# EAGLE design Irnardo_REVA (EAGLE 6.4)
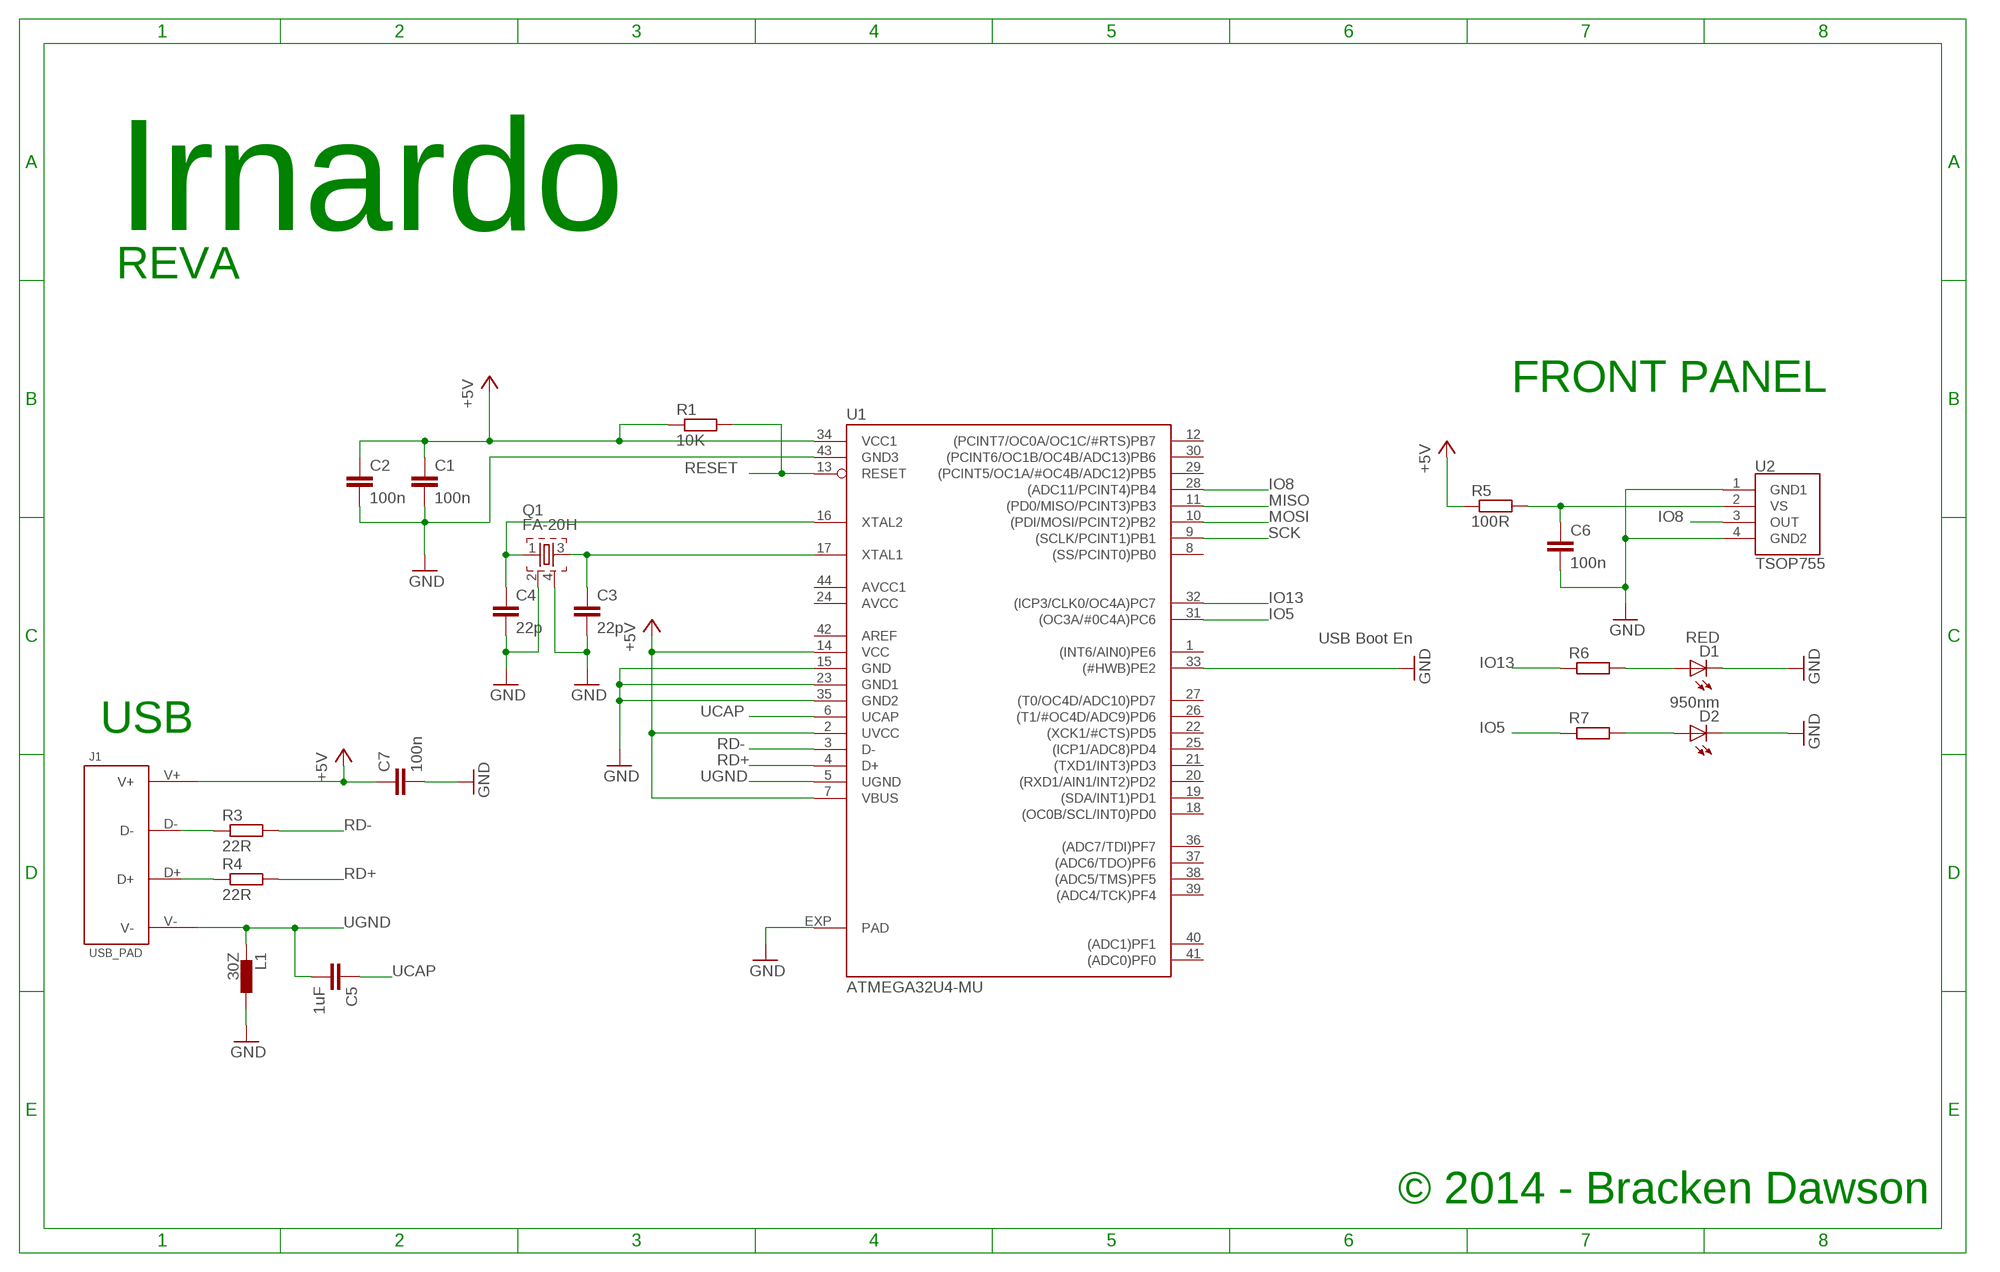
[diagram p0: schematic, sheet 1]

## Parts
C1  100n  C-EUC0402  [C0402]
C2  100n  C-EUC0402  [C0402]
C3  22p  C-EUC0402  [C0402]
C4  22p  C-EUC0402  [C0402]
C5  1uF  C-EUC0402  [C0402]
C6  100n  C-EUC0402  [C0402]
C7  100n  C-EUC0402  [C0402]
D1  RED  LEDSML0603  [SML0603]
D2  950nm  LEDSML0603  [SML0603]
J1  USB_PAD  [USB_PAD]
L1  30Z  BLM15HB121SN1  [0402]
Q1  FA-20H  [FA-20H]
R1  10K  R-EU_R0402  [R0402]
R3  22R  R-EU_R0402  [R0402]
R4  22R  R-EU_R0402  [R0402]
R5  100R  R-EU_R0402  [R0402]
R6  R-EU_R0402  [R0402]
R7  R-EU_R0402  [R0402]
U1  ATMEGA32U4-MU  SMARTPRJ_ATMEGA32U4-XUMU  [SMARTPRJ_QFN44ML7X7]
U2  TSOP755  [TSOP755]

## Nets
+5V: C1.1 C2.1 C7.1 J1.V+ R1.1 R5.1 U1.2(UVCC) U1.7(VBUS) U1.14(VCC) U1.34(VCC1)
D+: J1.D+ R4.1
D-: J1.D- R3.1
GND: C1.2 C2.2 C3.2 C4.2 C6.2 C7.2 D1.C D2.C L1.2 Q1.2 Q1.4 U1.15(GND) U1.23(GND1) U1.33((#HWB)PE2) U1.35(GND2) U1.43(GND3) U1.EXP(PAD) U2.1(GND1) U2.4(GND2)
IO5: R7.1 U1.31((OC3A/#0C4A)PC6)
IO8: U1.28((ADC11/PCINT4)PB4) U2.3(OUT)
IO13: R6.1 U1.32((ICP3/CLK0/OC4A)PC7)
MISO: U1.11((PD0/MISO/PCINT3)PB3)
MOSI: U1.10((PDI/MOSI/PCINT2)PB2)
N$1: C4.1 Q1.1 U1.16(XTAL2)
N$2: C3.1 Q1.3 U1.17(XTAL1)
N$5: C6.1 R5.2 U2.2(VS)
N$7: D2.A R7.2
N$8: D1.A R6.2
RD+: R4.2 U1.4(D+)
RD-: R3.2 U1.3(D-)
RESET: R1.2 U1.13(RESET)
SCK: U1.9((SCLK/PCINT1)PB1)
UCAP: C5.1 U1.6(UCAP)
UGND: C5.2 J1.V- L1.1 U1.5(UGND)
Unconnected: U1.1((INT6/AIN0)PE6) U1.8((SS/PCINT0)PB0) U1.12((PCINT7/OC0A/OC1C/#RTS)PB7) U1.18((OC0B/SCL/INT0)PD0) U1.19((SDA/INT1)PD1) U1.20((RXD1/AIN1/INT2)PD2) U1.21((TXD1/INT3)PD3) U1.22((XCK1/#CTS)PD5) U1.25((ICP1/ADC8)PD4) U1.26((T1/#OC4D/ADC9)PD6) U1.27((T0/OC4D/ADC10)PD7) U1.29((PCINT5/OC1A/#OC4B/ADC12)PB5) U1.30((PCINT6/OC1B/OC4B/ADC13)PB6) U1.36((ADC7/TDI)PF7) U1.37((ADC6/TDO)PF6) U1.38((ADC5/TMS)PF5) U1.39((ADC4/TCK)PF4) U1.40((ADC1)PF1) U1.41((ADC0)PF0)

## Notes on the sheet
- Irnardo
- REVA
- FRONT PANEL
- USB Boot En
- USB
- © 2014 - Bracken Dawson

## Power pins joined to a net without a drawn wire
AREF: U1.42(AREF)
AVCC: U1.24(AVCC)
AVCC1: U1.44(AVCC1)

## Library data of the parts
C1-C7 = resistor:C-EU: CAPACITOR, European symbol
D1 D2 = led:LED: LED OSRAM: - CHIPLED LG R971, LG N971, LY N971, LG Q971, LY Q971, LO R971, LY R971 LH N974, LH R974 LS Q976, LO Q976, LY Q976 LO Q996 - Hyper CHIPLED LW Q18S LB Q993, LB Q99A, LB R99A - SideLED LS A670, LO A670, LY A670, LG A670, LP A670 LB A673, LV A673, LT A673, LW A673 LH A674 LY A675 LS A676, LA A676, LO A676, LY A676, LW A676 LS A679, LY A679, LG A679 - Hyper Micro SIDELED® LS Y876, LA Y876, LO Y876, LY Y876 LT Y87S - SmartLED LW L88C, LW L88S LB L89C, LB L89S, LG L890 LS L89K, LO L89K, LY L89K LS L896, LA L896, LO L896, LY L896 - TOPLED LS T670, LO T670, LY T670, LG T670, LP T670 LSG T670, LSP T670, LSY T670, LOP T670, LYG T670 LG T671, LOG T671, LSG T671 LB T673, LV T673, LT T673, LW T673 LH T674 LS T676, LA T676, LO T676, LY T676, LB T676, LH T676, LSB T676, LW T676 LB T67C, LV T67C, LT T67C, LS T67K, LO T67K, LY T67K, LW E67C LS E67B, LA E67B, LO E67B, LY E67B, LB E67C, LV E67C, LT E67C LW T67C LS T679, LY T679, LG T679 LS T770, LO T770, LY T770, LG T770, LP T770 LB T773, LV T773, LT T773, LW T773 LH T774 LS E675, LA E675, LY E675, LS T675 LS T776, LA T776, LO T776, LY T776, LB T776 LHGB T686 LT T68C, LB T68C - Hyper Mini TOPLED® LB M676 - Mini TOPLED Santana® LG M470 LS M47K, LO M47K, LY M47K Source: http://www.osram.convergy.de LUXEON: - LUMILED® LXK2-PW12-R00, LXK2-PW12-S00, LXK2-PW14-U00, LXK2-PW14-V00 LXK2-PM12-R00, LXK2-PM12-S00, LXK2-PM14-U00 LXK2-PE12-Q00, LXK2-PE12-R00, LXK2-PE12-S00, LXK2-PE14-T00, LXK2-PE14-U00 LXK2-PB12-K00, LXK2-PB12-L00, LXK2-PB12-M00, LXK2-PB14-N00, LXK2-PB14-P00, LXK2-PB14-Q00 LXK2-PR12-L00, LXK2-PR12-M00, LXK2-PR14-Q00, LXK2-PR14-R00 LXK2-PD12-Q00, LXK2-PD12-R00, LXK2-PD12-S00 LXK2-PH12-R00, LXK2-PH12-S00 LXK2-PL12-P00, LXK2-PL12-Q00, LXK2-PL12-R00 Source: www.luxeon.com KINGBRIGHT: KA-3528ASYC Source: www.kingbright.com
J1 = USB_PAD:USB_PAD
L1 = inductors:BLM15H: EMIFIL (R) Chip Ferrite Bead for GHz Noise Source: http://www.murata.com/ Ferrite Bead BLM15H.pdf
Q1 = crystal:FA-: MHz RANGE CRYSTAL UNIT Source: Epson Toyocom
R1 R3-R7 = resistor:R-EU_: RESISTOR, European symbol
U1 = Arduino_Leonardo-REV3b:SMARTPRJ_ATMEGA32U4-XU
U2 = TSOP755:TSOP755; U: TSOP755

## Board
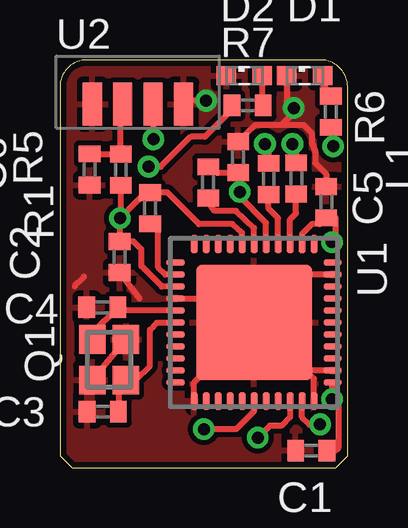
[diagram p1: board, top side]
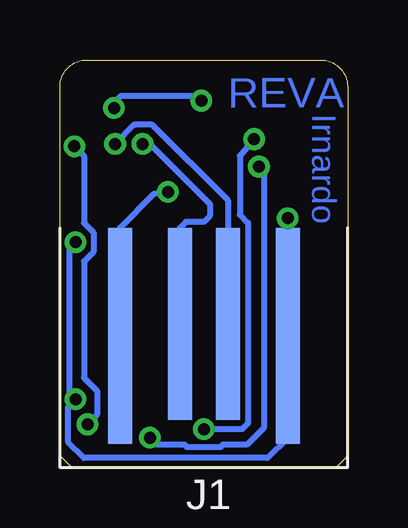
[diagram p2: board, bottom side, seen from below]

Size 12 x 17 mm. Coordinates in mm from the lower left corner, seen from the top.
Outline: 0,0.5 0.5,0 11.5,0 12,0.5 12,15.88 arc90 10.88,17 1.12,17 arc90 0,15.88 0,0.5
Copper layers (1*16): Top 0.035mm / dielectric 1.5mm / Bottom 0.035mm
Design rules "default *": minimum track width 10mil, minimum drill 20mil, track to track 8mil, track to pad 8mil, pad to pad 8mil, via to via 8mil, smd to smd 8mil, copper to edge 10mil, drill to drill 8mil, minimum pad ring 10mil, minimum via ring 8mil, stop-mask expansion 4mil, vias tented up to drill 0mil, thermal gap 10mil

### Footprints (pad centres in the part's own frame; a part is rotated, then mirrored left to right if it is on the bottom)
C0402 = smd 0.7 x 0.9: 1 -0.65,0; 2 0.65,0
SML0603 = smd 0.8 x 0.8: A 0.75,0; C -0.75,0
USB_PAD = smd 1 x 8: D+ -1,6; D- 1,6 | smd 1 x 9: V+ 3.5,5.5; V- -3.5,5.5
0402 = smd 0.7 x 0.9: 1 -0.65,0; 2 0.65,0
FA-20H = smd 1.2 x 1.1: 1 -0.85,-0.7; 2 0.85,-0.7; 3 0.85,0.7; 4 -0.85,0.7
R0402 = smd 0.7 x 0.9: 1 -0.65,0; 2 0.65,0
SMARTPRJ_QFN44ML7X7 = smd 0.75 x 0.275: 1 -3.275,2.5; 2 -3.275,2; 3 -3.275,1.5; 4 -3.275,1; 5 -3.275,0.5; 6 -3.275,0; 7 -3.275,-0.5; 8 -3.275,-1; 9 -3.275,-1.5; 10 -3.275,-2; 11 -3.275,-2.5; 23 3.275,-2.5; 24 3.275,-2; 25 3.275,-1.5; 26 3.275,-1; 27 3.275,-0.5; 28 3.275,0; 29 3.275,0.5; 30 3.275,1; 31 3.275,1.5; 32 3.275,2; 33 3.275,2.5 | smd 0.275 x 0.75: 12 -2.5,-3.275; 13 -2,-3.275; 14 -1.5,-3.275; 15 -1,-3.275; 16 -0.5,-3.275; 17 0,-3.275; 18 0.5,-3.275; 19 1,-3.275; 20 1.5,-3.275; 21 2,-3.275; 22 2.5,-3.275; 34 2.5,3.275; 35 2,3.275; 36 1.5,3.275; 37 1,3.275; 38 0.5,3.275; 39 0,3.275; 40 -0.5,3.275; 41 -1,3.275; 42 -1.5,3.275; 43 -2,3.275; 44 -2.5,3.275 | smd 4.826 x 4.826: EXP 0,0
TSOP755 = smd 0.8 x 1.8: 1 0,0; 2 1.27,0; 3 2.54,0; 4 3.81,0

### Placement (x,y rotation side)
C1  10.48,0.71 180 top
C2  2.49,8.78 270 top
C3  1.79,2.33 180 top
C4  1.77,6.68 180 top
C5  6.18,11.89 90 top
C6  1.24,12.43 270 top
C7  11.11,11.07 90 top
D1  10.21,16.34 0 top
D2  7.69,16.34 0 top
J1  6,0 0 bottom
L1  7.43,12.95 90 top
Q1  2.05,4.5 270 top
R1  3.76,10.82 270 top
R3  9.86,12.06 270 top
R4  8.71,12.04 270 top
R5  2.54,12.42 90 top
R6  11.3,14.84 90 top
R7  7.83,15.1 0 top
U1  8.1,6.05 270 top
U2  1.35,15.16 0 top

### Tracks (layer width: path | path; a pad name or v marks a point on that pad's centre or on a via)
+5V  (via drill 0.5)
  Top 0.254: U1.2 10.1,9.75 10.5,10.15 10.84,10.15 C7.1 11.5,10.42 11.5,9.55 v11.35,9.4 | v2.5,10.4 3.57,11.47 R1.1 4.48,11.47 5.8,10.15 7.2,10.15 7.6,9.8 U1.7 | v2.5,10.4 2.54,10.44 R5.1 2.49,11.82 | C1.1 11.51,0.71 11.63,0.83 11.63,2.57 v11.35,2.85 11.35,3.52 U1.34 | v2.5,10.4 v2.49,10.39 C2.1 3.07,9.43 3.4,9.1 3.4,8.4 4.25,7.55 U1.14
  Bottom 0.254: 2.5,10.5 v2.5,10.4 J1.V+ 2.5,1.25 3.35,0.4 11,0.4 11.65,1.05 11.65,2.55 v11.35,2.85 11.6,3.1 11.6,9.15 v11.35,9.4
D+  (via drill 0.5)
  Top 0.254: R4.1 8.71,13.34 v8.55,13.5
  Bottom 0.254: v8.55,13.5 8.25,13.5 5.75,11 5.75,10.5 6,10.25 6.75,10.25 7,10 J1.D+
D-  (via drill 0.5)
  Top 0.254: R3.1 9.86,13.34 v9.7,13.5
  Bottom 0.254: J1.D- 5,11.15 8.15,14.3 8.9,14.3 v9.7,13.5
GND  (via drill 0.5)
  Top 0.254: U1.EXP 10.1,8.05 U1.43 | U1.35 10.25,4.05 | 10.25,4.05 10.1,4.05 U1.EXP | U1.15 7.1,7.05 U1.EXP | U1.33 10.6,3.7 10.25,4.05 | 5.6,2.75 5.6,3.55 U1.EXP | 1.26,15.07 U2.1 | D1.C 9.46,15.29 v9.75,15 9.75,14.8 9.25,14.3 | v6.1,15.3 5.3,15.3 U2.4 | 0.62,7.57 1,7.95 | L1.2 8.18,14.3 9.25,14.3 | 9.25,14.3 10.15,14.3 10.5,13.95 10.5,13.55 10.65,13.15 10.65,12.7 11.11,12.24 C7.2 | 3.32,7.05 C2.2 | Q1.4 Q1.2
  Bottom 0.254: v6.1,15.3 6.3,15.5 9.46,15.5 9.75,15.21 v9.75,15
  pour Top: -0.5,17.5 -0.5,-0.5 12.5,-0.5 12.5,17.5
IO5  (via drill 0.5)
  Top 0.254: U1.31 9.6,2.1 9.25,1.75 8.75,1.75 v8.25,1.25 | R7.1 7.18,14.93 6.05,13.8 5.45,13.8 4.2,12.55 v3.7,12.55
  Bottom 0.254: v3.7,12.55 3.5,12.35 3.5,1.65 4.2,0.95 5.2,0.95 5.3,0.85 6.7,0.85 6.8,0.95 7.95,0.95 v8.25,1.25
IO8  (via drill 0.5)
  Top 0.254: U2.3 v3.89,13.71 v3.9,13.7 | U1.28 8.1,2.35 7.35,1.6 v6,1.6
  Bottom 0.254: v3.9,13.7 4.5,13 4.5,10.55 4.15,10.2 4.15,1.85 4.4,1.6 v6,1.6
IO13  (via drill 0.5)
  Top 0.254: R6.1 v11.4,13.4 | v10.85,1.8 10.4,1.8 10.1,2.1 U1.32
  Bottom 0.254: v11.4,13.4 11,13 11,10.2 10.6,9.8 10.6,9 11,8.6 11,3.75 10.45,3.2 10.45,2.2 v10.85,1.8
MOSI
  Top 0.254: U1.10 6.1,9.55
N$1
  Top 0.254: U1.16 2.42,6.55 C4.1 1.35,5.61 Q1.1
N$2
  Top 0.254: C3.1 2.2,2.07 | C3.1 2.45,2.59 | U1.17 4.05,6.05 3.75,5.75 3.75,4.25 3.15,3.65 Q1.3 2.44,3.34 C3.1
N$5
  Top 0.254: U2.2 2.54,15.08 R5.2 C6.1
N$7
  Top 0.254: R7.2 8.44,15.14 D2.A
N$8
  Top 0.254: D1.A 10.96,15.98 R6.2
RD+
  Top 0.254: U1.4 9.1,10.4 8.7,10.8 8.7,11.25 R4.2
RD-
  Top 0.254: U1.3 9.6,10.35 9.85,10.6 9.85,11.22 R3.2
RESET
  Top 0.254: U1.13 4.4,8.05 4.1,8.35 4.1,9.83 R1.2
UCAP
  Top 0.254: U1.6 8.1,10 7.35,10.7 6.45,10.7 6.18,11.07 C5.1
UGND  (via drill 0.5)
  Top 0.254: U1.5 8.6,10.2 7.5,11.3 v7.5,11.5 7.48,12.17 L1.1 6.55,12.3 6.25,12.5 6.22,12.5 C5.2
  Bottom 0.254: v7.5,11.5 8.1,11.4 9.5,10 J1.V-

### Text on the board
Bottom: Irnardo | REVA